# Altium schematic sheet Buffer.SchDoc
size A
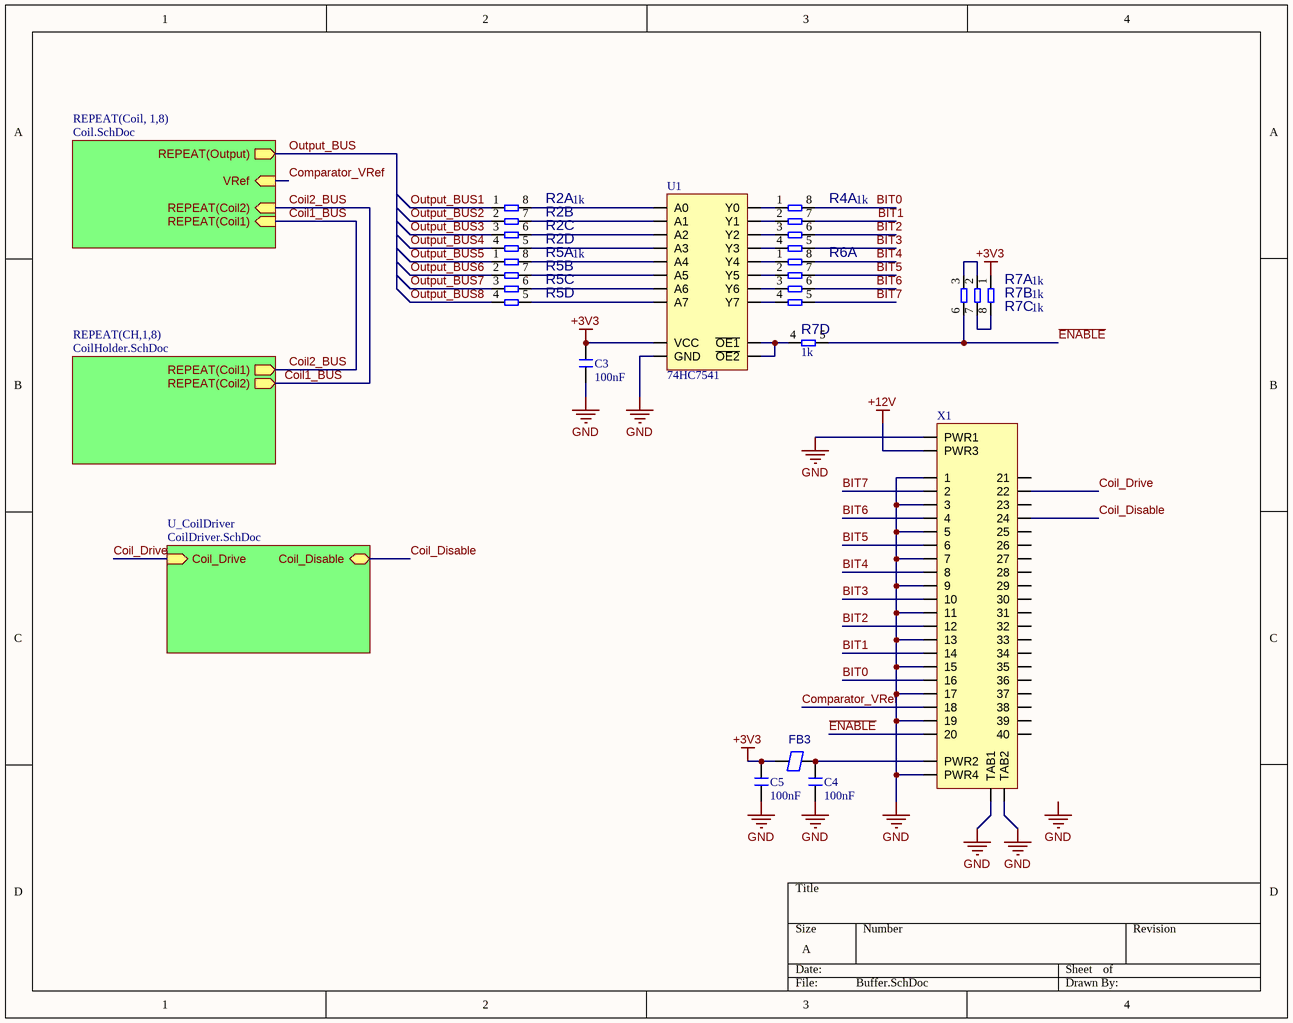
[diagram p0: Buffer.SchDoc]

## Parts
C3  100nF  [C0603_N]
C4  100nF  [C0603_N]
C5  100nF  [C0603_N]
FB3  Ferrite Bead  [F0603_N]  (value not drawn)
R2  value 1k  [YC164]  (hidden comment: Resistor Array - 4P)  (parts A,B,C,D of 4)
R4  value 1k  [YC164]  (hidden comment: Resistor Array - 4P)  (parts A,B,C,D of 4)
R5  Resistor Array - 4P  [YC164]  (value not drawn)  (parts A,B,C,D of 4)
R6  Resistor Array - 4P  [YC164]  (value not drawn)  (parts A,B,C,D of 4)
R7  value 1k  [YC164]  (hidden comment: Resistor Array - 4P)  (parts A,B,C,D of 4)
U1  74HC7541  [TSSOP20_N]
X1  FX23 Right Angle Receptacle  [FX23-40S-0.5SH]  (value not drawn)

## Sub-sheets
REPEAT(CH,1,8) = CoilHolder.SchDoc: REPEAT(Coil1) (out), REPEAT(Coil2) (out)
REPEAT(Coil, 1,8) = Coil.SchDoc: REPEAT(Output) (out), VRef (in), REPEAT(Coil1) (in), REPEAT(Coil2) (in)
U_CoilDriver = CoilDriver.SchDoc: Coil_Drive (in), Coil_Disable (bidir)

## Nets
+3V3: C3.1 C5.1 FB3.2 R7.1 U1.20(VCC)
+12V: X1.PWR3
GND: C3.2 C4.2 C5.2 U1.10(GND) X1.1 X1.3 X1.5 X1.7 X1.9 X1.11 X1.13 X1.15 X1.17 X1.19 X1.PWR1 X1.PWR4 X1.TAB1 X1.TAB2
BIT0: R4.8 X1.16
BIT1: R4.7 X1.14
BIT2: R4.6 X1.12
BIT3: R4.5 X1.10
BIT4: R6.8 X1.8
BIT5: R6.7 X1.6
BIT6: R6.6 X1.4
BIT7: R6.5 X1.2
Coil1_BUS: sheet REPEAT(Coil, 1,8)/REPEAT(Coil1), sheet REPEAT(CH,1,8)/REPEAT(Coil2)
Coil2_BUS: sheet REPEAT(Coil, 1,8)/REPEAT(Coil2), sheet REPEAT(CH,1,8)/REPEAT(Coil1)
Coil_Disable: X1.24 ; sheet U_CoilDriver/Coil_Disable
Coil_Drive: X1.22 ; sheet U_CoilDriver/Coil_Drive
Comparator_VRef: X1.18 ; sheet REPEAT(Coil, 1,8)/VRef
~{ENABLE}: R7.5 R7.6 X1.20
Output_BUS: sheet REPEAT(Coil, 1,8)/REPEAT(Output)
Output_BUS1: R2.1
Output_BUS2: R2.2
Output_BUS3: R2.3
Output_BUS4: R2.4
Output_BUS5: R5.1
Output_BUS6: R5.2
Output_BUS7: R5.3
Output_BUS8: R5.4
NetC4_1: C4.1 FB3.1 X1.PWR2
NetR2_5: R2.5 U1.5(A3)
NetR2_6: R2.6 U1.4(A2)
NetR2_7: R2.7 U1.3(A1)
NetR2_8: R2.8 U1.2(A0)
NetR4_1: R4.1 U1.18(Y0)
NetR4_2: R4.2 U1.17(Y1)
NetR4_3: R4.3 U1.16(Y2)
NetR4_4: R4.4 U1.15(Y3)
NetR5_5: R5.5 U1.9(A7)
NetR5_6: R5.6 U1.8(A6)
NetR5_7: R5.7 U1.7(A5)
NetR5_8: R5.8 U1.6(A4)
NetR6_1: R6.1 U1.14(Y4)
NetR6_2: R6.2 U1.13(Y5)
NetR6_3: R6.3 U1.12(Y6)
NetR6_4: R6.4 U1.11(Y7)
NetR7_2: R7.2 R7.3
NetR7_4: R7.4 U1.1(~{OE1}) U1.19(~{OE2})
NetR7_7: R7.7 R7.8

Not connected (* = marked no-connect by the designer): X1 21 23 25 26 27 28 29 30 31 32 33 34 35 36 37 38 39 40

## Notes on the sheet
- Labels drawn without touching a wire or pin: GND

## Library data of the parts
C3-C5 = Capacitor: Capacitor MLCC; Manufacturer: Yageo; Manufacturer Part Number: CC0603KRX7R9BB104; Tolerance (%): 10; Category: Capacitor; Package: 0603; Value: 100nF; Supplier Part Number 1: 1362556; Supplier 1: Farnell; ComponentLink1URL: http://www.yageo.com; ComponentLink1Description: Manufacturer Website; Voltage Rating (Volts): *; Supplier 2: Digi-Key; Supplier Part Number 2: 311-1344-1-ND
R5 R6 = Resistor Array - 4P: Value: 1k
U1 = 74HC7541: Schmitt Trigger Octal
X1 = FX23-40S-0.5SH: FX23 Right Angle Receptacle 40 Pos